# Altium schematic sheet MCU.SchDoc
size A4
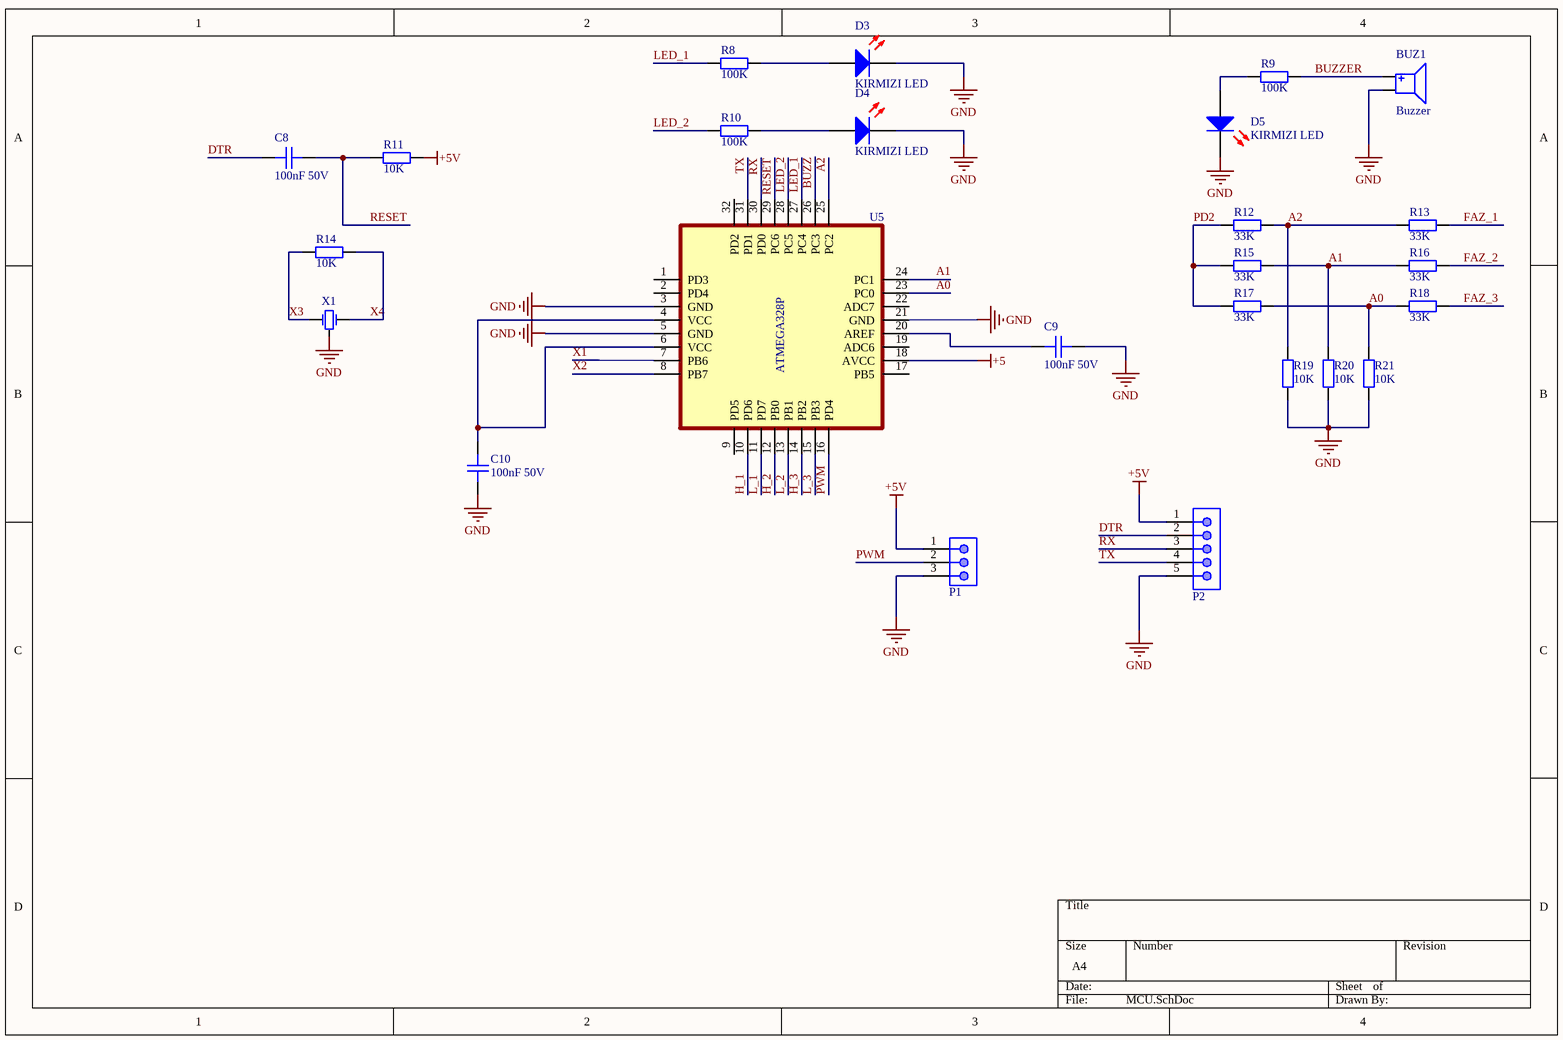
[diagram p0: MCU.SchDoc]

## Parts
BUZ1  Deger: Buzzer  [BUZ: CMT-7525]  (hidden comment: BUZZER MAGN 3.6V 7.5X7.5MM SMD)
C8  Deger: 100nF 50V  [CAP 0805/2012]  (hidden comment: CAP CER 0.1UF 50V X7R 0805)
C9  Deger: 100nF 50V  [CAP 0805/2012]  (hidden comment: CAP CER 0.1UF 50V X7R 0805)
C10  Deger: 100nF 50V  [CAP 0805/2012]  (hidden comment: CAP CER 0.1UF 50V X7R 0805)
D3  Deger: KIRMIZI LED  [SMD: LED 0805/2012 RED]  (hidden comment: Red 645nm LED Indication - Discrete 1.8V 0805)
D4  Deger: KIRMIZI LED  [SMD: LED 0805/2012 RED]  (hidden comment: Red 645nm LED Indication - Discrete 1.8V 0805)
D5  Deger: KIRMIZI LED  [SMD: LED 0805/2012 RED]  (hidden comment: Red 645nm LED Indication - Discrete 1.8V 0805)
P1  WR-PHD 2.54 mm Angled Socket Header  [PWM_CONN]  (value not drawn)
P2  WR-PHD 2.54 mm Angled Socket Header  [TTL_CONN_5]  (value not drawn)
R8  Deger: 100K  [RES_0805]  (hidden comment: RES SMD 100K OHM 1% 1/8W 0805)
R9  Deger: 100K  [RES_0805]  (hidden comment: RES SMD 100K OHM 1% 1/8W 0805)
R10  Deger: 100K  [RES_0805]  (hidden comment: RES SMD 100K OHM 1% 1/8W 0805)
R11  Deger: 10K  [RES_0805]  (hidden comment: RES SMD 10K OHM 1% 1/8W 0805)
R12  Deger: 33K  [RES_0805]  (hidden comment: RES SMD 33K OHM 1% 1/8W 0805)
R13  Deger: 33K  [RES_0805]  (hidden comment: RES SMD 33K OHM 1% 1/8W 0805)
R14  Deger: 10K  [RES_0805]  (hidden comment: RES SMD 10K OHM 1% 1/8W 0805)
R15  Deger: 33K  [RES_0805]  (hidden comment: RES SMD 33K OHM 1% 1/8W 0805)
R16  Deger: 33K  [RES_0805]  (hidden comment: RES SMD 33K OHM 1% 1/8W 0805)
R17  Deger: 33K  [RES_0805]  (hidden comment: RES SMD 33K OHM 1% 1/8W 0805)
R18  Deger: 33K  [RES_0805]  (hidden comment: RES SMD 33K OHM 1% 1/8W 0805)
R19  Deger: 10K  [RES_0805]  (hidden comment: RES SMD 10K OHM 1% 1/8W 0805)
R20  Deger: 10K  [RES_0805]  (hidden comment: RES SMD 10K OHM 1% 1/8W 0805)
R21  Deger: 10K  [RES_0805]  (hidden comment: RES SMD 10K OHM 1% 1/8W 0805)
U5  IC MCU 8BIT 32KB FLASH 32TQFP  [TQFP32]  (value not drawn)
X1  CERAMIC RES 16.0000MHZ 15PF SMD  [CRYSTAL_16MHZ(CTSE16)]  (value not drawn)

## Nets
+5: U5.18(AVCC)
+5V: P1.1 P2.1 R11.2
GND: BUZ1.2(Negative) C9.2 C10.1 D3.2(K) D4.2(K) D5.2(K) P1.3 P2.5 R19.1 R20.1 R21.1 U5.3(GND) U5.5(GND) U5.21(GND) X1.2(GND)
A0: R17.2 R18.1 R21.2 U5.23(PC0)
A1: R15.2 R16.1 R20.2 U5.24(PC1)
A2: R12.2 R13.1 R19.2 U5.25(PC2)
BUZZ: U5.26(PC3)
BUZZER: BUZ1.1(Positive) R9.2
DTR: C8.1 P2.2
FAZ_1: R13.2
FAZ_2: R16.2
FAZ_3: R18.2
H_1: U5.10(PD6)
H_2: U5.12(PB0)
H_3: U5.14(PB2)
L_1: U5.11(PD7)
L_2: U5.13(PB1)
L_3: U5.15(PB3)
LED_1: R8.1 U5.27(PC4)
LED_2: R10.1 U5.28(PC5)
PD2: R12.1 R15.1 R17.1
PWM: P1.2 U5.16(PD4)
RESET: C8.2 R11.1 U5.29(PC6)
RX: P2.3 U5.30(PD0)
TX: P2.4 U5.31(PD1)
X1: U5.7(PB6)
X2: U5.8(PB7)
X3: R14.1 X1.1(OSC1)
X4: R14.2 X1.3(OSC2)
NetC9_1: C9.1 U5.20(AREF)
NetC10_2: C10.2 U5.4(VCC) U5.6(VCC)
NetD3_1: D3.1(A) R8.2
NetD4_1: D4.1(A) R10.2
NetD5_1: D5.1(A) R9.1

Not connected (* = marked no-connect by the designer): U5 1(PD3) 2(PD4) 9(PD5) 17(PB5) 19(ADC6) 22(ADC7) 32(PD2)

## Library data of the parts
BUZ1 = Buzzer(CMT-7525-80-SMT-TR): Buzzers Transducer, Externally Driven Magnetic 3.6V 100mA 2.73kHz 80dB @ 3.6V, 10cm Surface Mount Solder Pads; Kılıf: Nonstandard; -Sicaklik: -40; +Sicaklik: +85; Cins: Buzzer; Uretici Kodu: CMT-7525-80-SMT-TR; MSL: 1 (Unlimited); Lehim Yöntemi: SMD
C8-C10 = 100nF 50V 0805: 0.1µF ±10% 50V Ceramic Capacitor X7R 0805 (2012 Metric); Kılıf: 0805; Cins: Kondansator; Uretici Kodu: CL21B104KBCNNNC; -Sicaklik: -55; +Sicaklik: +125; Lehim Yöntemi: SMD; MSL: 1 (Unlimited)
D3-D5 = LED_Kırmızı: LED RED DIFFUSED 0805 SMD; Uretici Kodu: LH R974-LP-1; Kılıf: 0805; -Sicaklik: -40; +Sicaklik: +125; Cins: LED; Lehim Yöntemi: SMD; MSL: 1 (Unlimited)
P1 = HDR(1X3): Cins: Konnektor; Uretici Kodu: 613003143121; Kılıf: 3POS 2.54MM; -Sicaklik: -40; +Sicaklik: +105; Lehim Yöntemi: MANUEL; MSL: 1 (Unlimited)
P2 = HDR(1X5): Cins: Konnektor; Uretici Kodu: 613005143121; Kılıf: 5POS 2.54MM; -Sicaklik: -40; +Sicaklik: +105; Lehim Yöntemi: MANUEL; MSL: 1 (Unlimited)
R8-R10 = 100K 0805: 100 kOhms ±1% 0.125W, 1/8W Chip Resistor 0805 (2012 Metric) Moisture Resistant Thick Film; Cins: Direnc; Uretici Kodu: RC0805FR-07100KL; Kılıf: 0805; -Sicaklik: -55; +Sicaklik: +155; Lehim Yöntemi: SMD; MSL: 1 (Unlimited)
R11 R14 R19-R21 = 10K 0805: 10 kOhms ±1% 0.125W, 1/8W Chip Resistor 0805 (2012 Metric) Moisture Resistant Thick Film; Cins: Direnc; Kılıf: 0805; Uretici Kodu: RC0805FR-0710KL; -Sicaklik: -55; +Sicaklik: +155; Lehim Yöntemi: SMD; MSL: 1 (Unlimited)
R12 R13 R15-R18 = 33K 0805: 33 kOhms ±1% 0.125W, 1/8W Chip Resistor 0805 (2012 Metric) Moisture Resistant Thick Film; Cins: Direnc; Kılıf: 0805; -Sicaklik: -55; +Sicaklik: +155; Uretici Kodu: RC0805FR-0733KL; MSL: 1 (Unlimited); Lehim Yöntemi: SMD
U5 = ATMEGA328P: AVR AVR® ATmega Microcontroller IC 8-Bit 20MHz 32KB (16K x 16) FLASH 32-TQFP (7x7); Uretici Kodu: RC0805FR-07100RL; -Sicaklik: -40; +Sicaklik: +85; Lehim Yöntemi: SMD; Cins: IC; Kılıf: 32-TQFP; MSL: 3 (168 Hours); Deger: ATMEGA328P
X1 = CRYSTAL 16.0000MHZ(CSTCE16M0V53-R0): 16MHz Ceramic Resonator Built in Capacitor 15pF ±0.3%  -20°C ~ 80°C Surface Mount; Cins: Kristal; Kılıf: 3-SMD; -Sicaklik: -20; +Sicaklik: +80; Deger: 16 MHZ 15PF; Uretici Kodu: CSTCE16M0V53-R0; Lehim Yöntemi: SMD; MSL: 1 (Unlimited)